# EAGLE schematic Titan_6L_v1p3 (EAGLE 9.6.2)

## Sheet 1 of 5: CPU
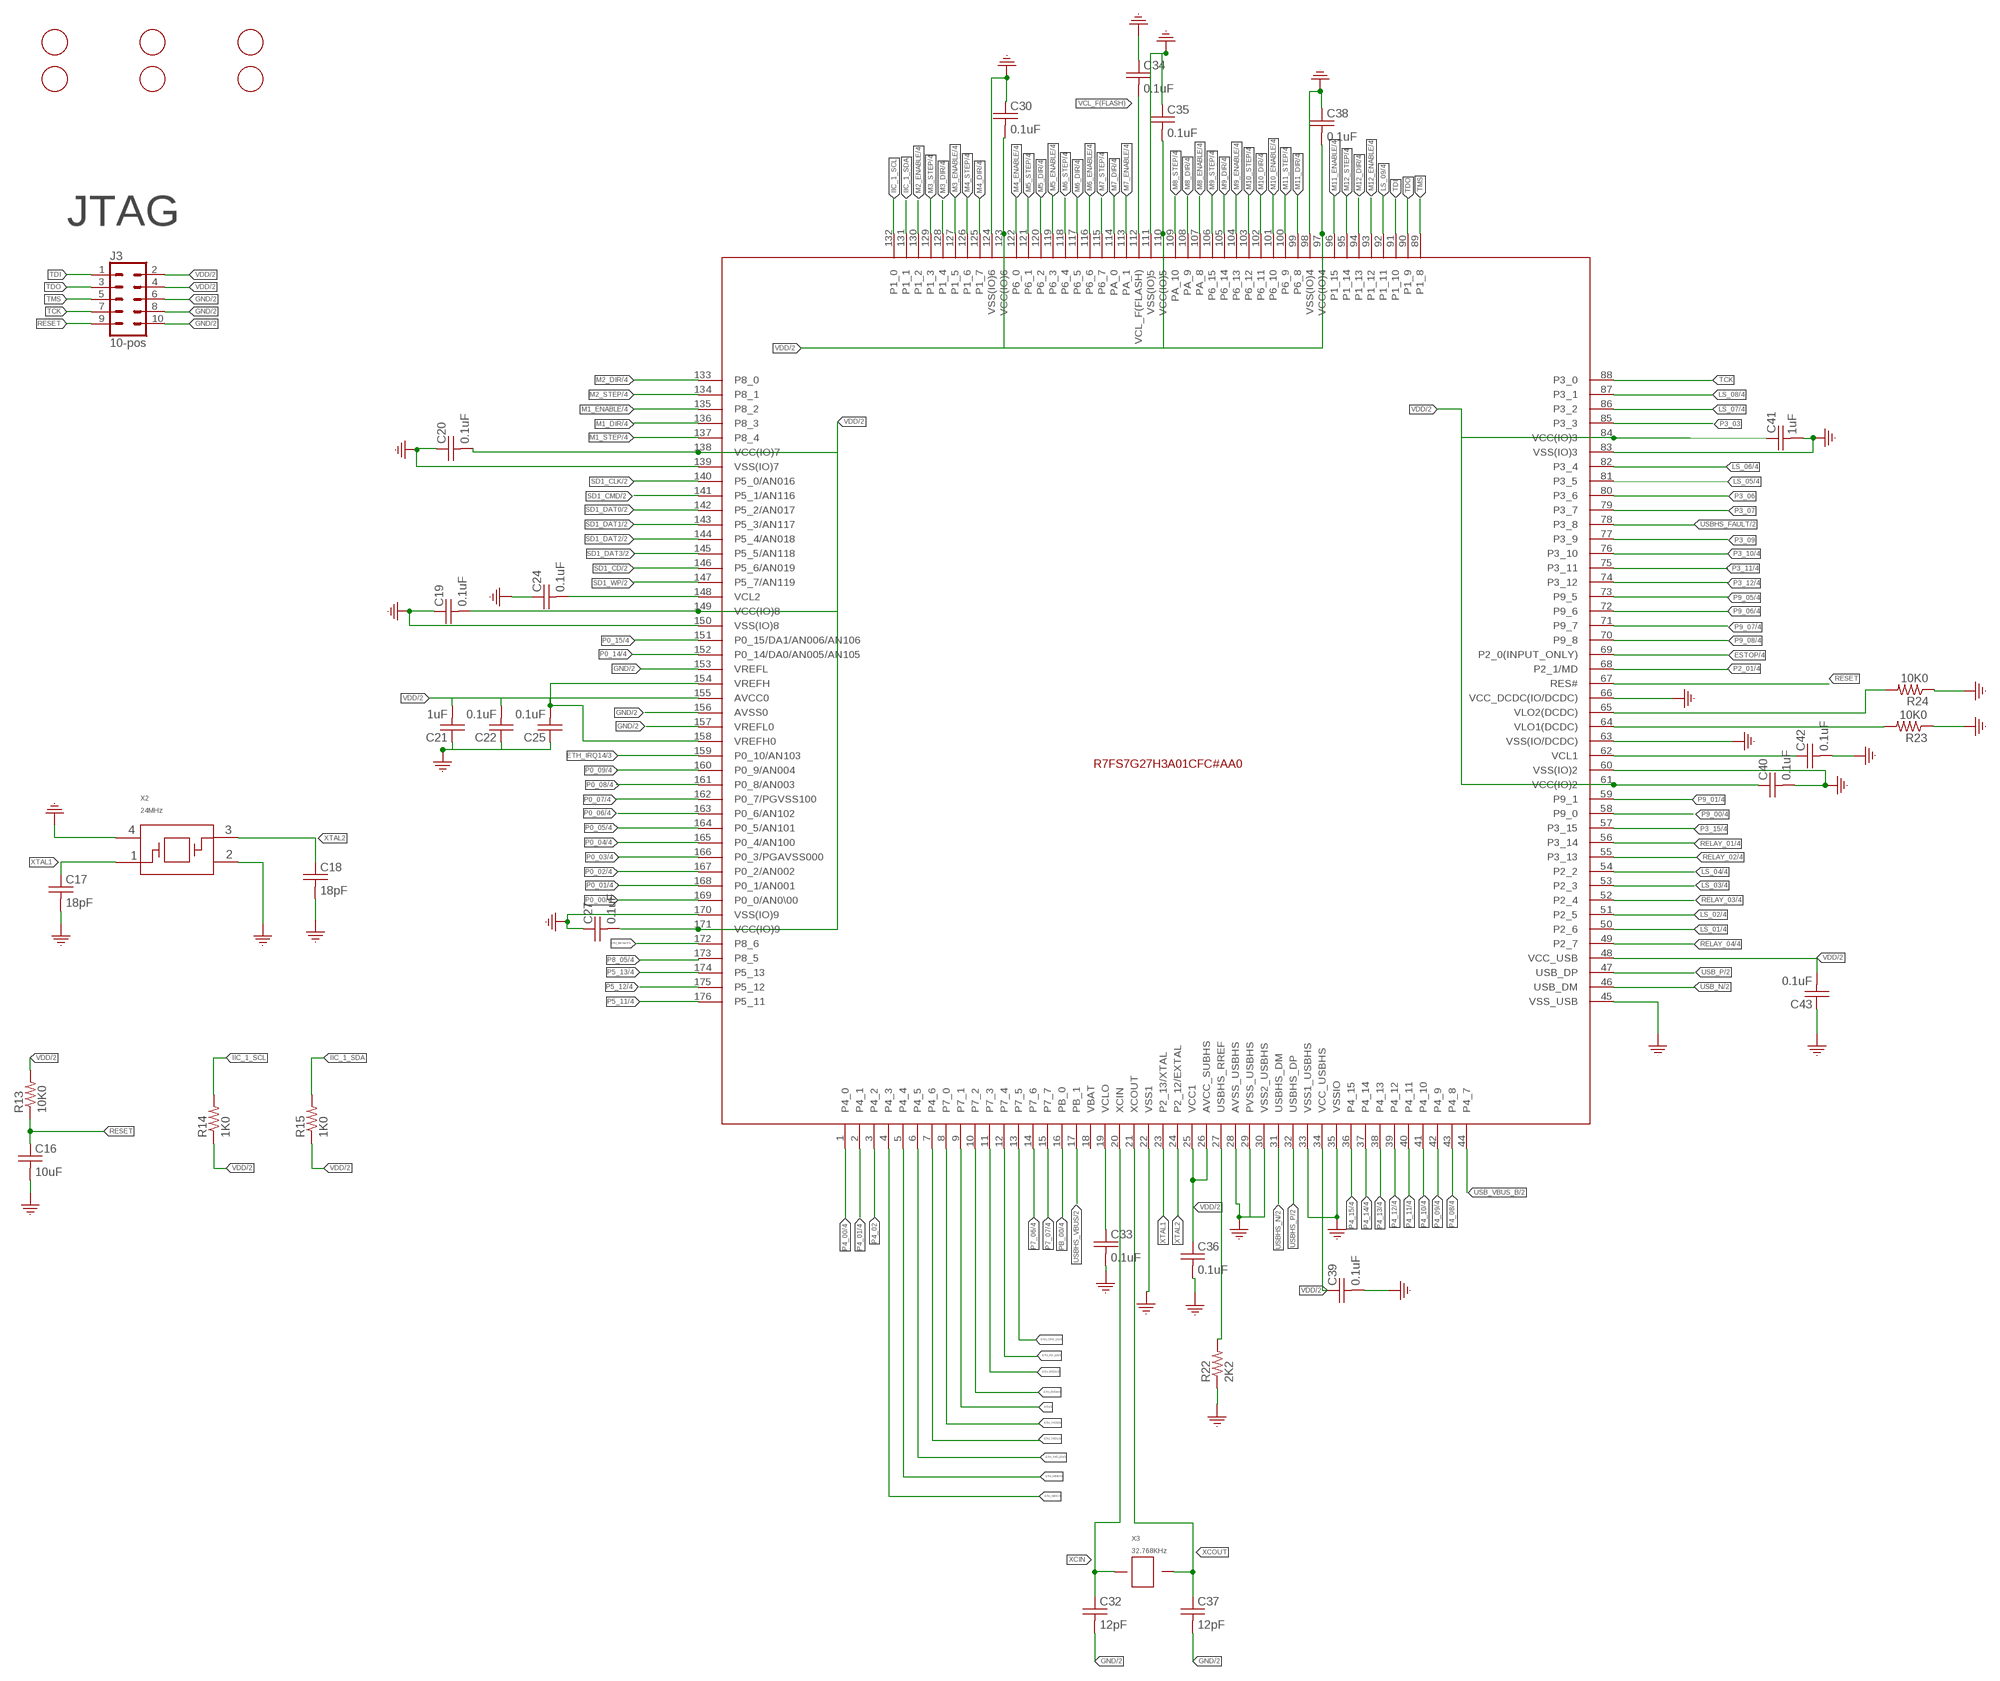
[diagram p0: schematic, sheet 1]

### Parts
AFID1  FIDUCIAL_1MM  [FIDUCIAL_1MM]
AFID2  FIDUCIAL_1MM  [FIDUCIAL_1MM]
AFID3  FIDUCIAL_1MM  [FIDUCIAL_1MM]
AFID4  FIDUCIAL_1MM  [FIDUCIAL_1MM]
AFID5  FIDUCIAL_1MM  [FIDUCIAL_1MM]
AFID6  FIDUCIAL_1MM  [FIDUCIAL_1MM]
C16  10uF  C_0402_10UF  [0402]
C17  18pF  C_0402_18PF  [0402]
C18  18pF  C_0402_18PF  [0402]
C19  0.1uF  C_0402_0.1UF  [0402]
C20  0.1uF  C_0402_0.1UF  [0402]
C21  1uF  C_0402_1UF  [0402]
C22  0.1uF  C_0402_0.1UF  [0402]
C24  0.1uF  C_0402_0.1UF  [0402]
C25  0.1uF  C_0402_0.1UF  [0402]
C27  0.1uF  C_0402_0.1UF  [0402]
C30  0.1uF  C_0402_0.1UF  [0402]
C32  12pF  C_0402_12PF  [0402]
C33  0.1uF  C_0402_0.1UF  [0402]
C34  0.1uF  C_0402_0.1UF  [0402]
C35  0.1uF  C_0402_0.1UF  [0402]
C36  0.1uF  C_0402_0.1UF  [0402]
C37  12pF  C_0402_12PF  [0402]
C38  0.1uF  C_0402_0.1UF  [0402]
C39  0.1uF  C_0402_0.1UF  [0402]
C40  0.1uF  C_0402_0.1UF  [0402]
C41  1uF  C_0402_1UF  [0402]
C42  0.1uF  C_0402_0.1UF  [0402]
C43  0.1uF  C_0402_0.1UF  [0402]
J3  10-pos  CONN_05X2_RAPTH  [2X5]
R13  10K0  R_0402_10K0  [0402]
R14  1K0  R_0402_1K0  [0402]
R15  1K0  R_0402_1K0  [0402]
R22  2K2  R_0402_2K2  [0402]
R23  10K0  R_0402_10K0  [0402]
R24  10K0  R_0402_10K0  [0402]
U3  S7G2LQFP176  RENESAS_S7G2_X_176  [LQFP176_24X24]
X2  24MHz  XTAL_24_MHZ  [SMD_3225]
X3  32.768KHz  XTAL_32.768KHZ  [SMD_X_2_PADS]

### Nets
ESTOP: U3.69(P2_0(INPUT_ONLY)) ; also sheet 4
ETH: U3.9(P7_1) ; also sheet 3
ETH_CRS_DV: U3.13(P7_5) ; also sheet 3
ETH_IRQ14: U3.159(P0_10/AN103) ; also sheet 3
ETH_MDC: U3.4(P4_3) ; also sheet 3
ETH_MDIO: U3.5(P4_4) ; also sheet 3
ETH_RESET: U3.172(P8_6) ; also sheet 3
ETH_RX_ER: U3.12(P7_4) ; also sheet 3
ETH_RXD0: U3.10(P7_2) ; also sheet 3
ETH_RXD1: U3.11(P7_3) ; also sheet 3
ETH_TXD0: U3.8(P7_0) ; also sheet 3
ETH_TXD1: U3.7(P4_6) ; also sheet 3
ETH_TXD_EN: U3.6(P4_5) ; also sheet 3
GND: C16.P$2 C17.P$2 C18.P$2 C19.P$1 C20.P$1 C21.P$1 C22.P$1 C24.P$1 C25.P$1 C27.P$1 C30.P$1 C32.P$2 C33.P$2 C34.P$1 C35.P$1 C36.P$2 C37.P$2 C38.P$1 C39.P$2 C40.P$2 C41.P$2 C42.P$2 C43.P$1 J3.6 J3.8 J3.10 R22.P$1 R23.P$1 R24.P$1 U3.22(VSS1) U3.28(AVSS_USBHS) U3.29(PVSS_USBHS) U3.30(VSS2_USBHS) U3.33(VSS1_USBHS) U3.35(VSSIO) U3.45(VSS_USB) U3.60(VSS(IO)2) U3.63(VSS(IO/DCDC)) U3.66(VCC_DCDC(IO/DCDC)) U3.83(VSS(IO)3) U3.98(VSS(IO)4) U3.111(VSS(IO)5) U3.124(VSS(IO)6) U3.139(VSS(IO)7) U3.150(VSS(IO)8) U3.153(VREFL) U3.156(AVSS0) U3.157(VREFL0) U3.170(VSS(IO)9) X2.2 X2.4 ; also sheet 2,3,4,5
IIC_1_SCL: R14.P$2 U3.132(P1_0)
IIC_1_SDA: R15.P$2 U3.131(P1_1)
LS_01: U3.50(P2_6) ; also sheet 4
LS_02: U3.51(P2_5) ; also sheet 4
LS_03: U3.53(P2_3) ; also sheet 4
LS_04: U3.54(P2_2) ; also sheet 4
LS_05: U3.81(P3_5) ; also sheet 4
LS_06: U3.82(P3_4) ; also sheet 4
LS_07: U3.86(P3_2) ; also sheet 4
LS_08: U3.87(P3_1) ; also sheet 4
LS_09: U3.92(P1_11) ; also sheet 4
M1_DIR: U3.136(P8_3) ; also sheet 4
M1_ENABLE: U3.135(P8_2) ; also sheet 4
M1_STEP: U3.137(P8_4) ; also sheet 4
M2_DIR: U3.133(P8_0) ; also sheet 4
M2_ENABLE: U3.130(P1_2) ; also sheet 4
M2_STEP: U3.134(P8_1) ; also sheet 4
M3_DIR: U3.128(P1_4) ; also sheet 4
M3_ENABLE: U3.127(P1_5) ; also sheet 4
M3_STEP: U3.129(P1_3) ; also sheet 4
M4_DIR: U3.125(P1_7) ; also sheet 4
M4_ENABLE: U3.122(P6_0) ; also sheet 4
M4_STEP: U3.126(P1_6) ; also sheet 4
M5_DIR: U3.120(P6_2) ; also sheet 4
M5_ENABLE: U3.119(P6_3) ; also sheet 4
M5_STEP: U3.121(P6_1) ; also sheet 4
M6_DIR: U3.117(P6_5) ; also sheet 4
M6_ENABLE: U3.116(P6_6) ; also sheet 4
M6_STEP: U3.118(P6_4) ; also sheet 4
M7_DIR: U3.114(PA_0) ; also sheet 4
M7_ENABLE: U3.113(PA_1) ; also sheet 4
M7_STEP: U3.115(P6_7) ; also sheet 4
M8_DIR: U3.108(PA_9) ; also sheet 4
M8_ENABLE: U3.107(PA_8) ; also sheet 4
M8_STEP: U3.109(PA_10) ; also sheet 4
M9_DIR: U3.105(P6_14) ; also sheet 4
M9_ENABLE: U3.104(P6_13) ; also sheet 4
M9_STEP: U3.106(P6_15) ; also sheet 4
M10_DIR: U3.102(P6_11) ; also sheet 4
M10_ENABLE: U3.101(P6_10) ; also sheet 4
M10_STEP: U3.103(P6_12) ; also sheet 4
M11_DIR: U3.99(P6_8) ; also sheet 4
M11_ENABLE: U3.96(P1_15) ; also sheet 4
M11_STEP: U3.100(P6_9) ; also sheet 4
M12_DIR: U3.94(P1_13) ; also sheet 4
M12_ENABLE: U3.93(P1_12) ; also sheet 4
M12_STEP: U3.95(P1_14) ; also sheet 4
N$1: C24.P$2 U3.148(VCL2)
N$4: C33.P$1 U3.19(VCLO)
N$5: C42.P$1 U3.62(VCL1)
N$6: R23.P$2 U3.64(VLO1(DCDC))
N$7: R24.P$2 U3.65(VLO2(DCDC))
N$8: R22.P$2 U3.27(USBHS_RREF)
P0_00: U3.169(P0_0/AN0\00) ; also sheet 4
P0_01: U3.168(P0_1/AN001) ; also sheet 4
P0_02: U3.167(P0_2/AN002) ; also sheet 4
P0_03: U3.166(P0_3/PGAVSS000) ; also sheet 4
P0_04: U3.165(P0_4/AN100) ; also sheet 4
P0_05: U3.164(P0_5/AN101) ; also sheet 4
P0_06: U3.163(P0_6/AN102) ; also sheet 4
P0_07: U3.162(P0_7/PGVSS100) ; also sheet 4
P0_08: U3.161(P0_8/AN003) ; also sheet 4
P0_09: U3.160(P0_9/AN004) ; also sheet 4
P0_14: U3.152(P0_14/DA0/AN005/AN105) ; also sheet 4
P0_15: U3.151(P0_15/DA1/AN006/AN106) ; also sheet 4
P2_01: U3.68(P2_1/MD) ; also sheet 4
P3_03: U3.85(P3_3)
P3_06: U3.80(P3_6)
P3_07: U3.79(P3_7)
P3_09: U3.77(P3_9)
P3_10: U3.76(P3_10) ; also sheet 4
P3_11: U3.75(P3_11) ; also sheet 4
P3_12: U3.74(P3_12) ; also sheet 4
P3_15: U3.57(P3_15) ; also sheet 4
P4_00: U3.1(P4_0) ; also sheet 4
P4_01: U3.2(P4_1) ; also sheet 4
P4_02: U3.3(P4_2)
P4_08: U3.43(P4_8) ; also sheet 4
P4_09: U3.42(P4_9) ; also sheet 4
P4_10: U3.41(P4_10) ; also sheet 4
P4_11: U3.40(P4_11) ; also sheet 4
P4_12: U3.39(P4_12) ; also sheet 4
P4_13: U3.38(P4_13) ; also sheet 4
P4_14: U3.37(P4_14) ; also sheet 4
P4_15: U3.36(P4_15) ; also sheet 4
P5_11: U3.176(P5_11) ; also sheet 4
P5_12: U3.175(P5_12) ; also sheet 4
P5_13: U3.174(P5_13) ; also sheet 4
P7_06: U3.14(P7_6) ; also sheet 4
P7_07: U3.15(P7_7) ; also sheet 4
P8_05: U3.173(P8_5) ; also sheet 4
P9_00: U3.58(P9_0) ; also sheet 4
P9_01: U3.59(P9_1) ; also sheet 4
P9_05: U3.73(P9_5) ; also sheet 4
P9_06: U3.72(P9_6) ; also sheet 4
P9_07: U3.71(P9_7) ; also sheet 4
P9_08: U3.70(P9_8) ; also sheet 4
PB_00: U3.16(PB_0) ; also sheet 4
RELAY_01: U3.56(P3_14) ; also sheet 4
RELAY_02: U3.55(P3_13) ; also sheet 4
RELAY_03: U3.52(P2_4) ; also sheet 4
RELAY_04: U3.49(P2_7) ; also sheet 4
RESET: C16.P$1 J3.9 R13.P$1 U3.67(RES#)
SD1_CD: U3.146(P5_6/AN019) ; also sheet 2
SD1_CLK: U3.140(P5_0/AN016) ; also sheet 2
SD1_CMD: U3.141(P5_1/AN116) ; also sheet 2
SD1_DAT0: U3.142(P5_2/AN017) ; also sheet 2
SD1_DAT1: U3.143(P5_3/AN117) ; also sheet 2
SD1_DAT2: U3.144(P5_4/AN018) ; also sheet 2
SD1_DAT3: U3.145(P5_5/AN118) ; also sheet 2
SD1_WP: U3.147(P5_7/AN119) ; also sheet 2
TCK: J3.7 U3.88(P3_0)
TDI: J3.1 U3.91(P1_10)
TDO: J3.3 U3.90(P1_9)
TMS: J3.5 U3.89(P1_8)
USB_N: U3.46(USB_DM) ; also sheet 2
USB_P: U3.47(USB_DP) ; also sheet 2
USB_VBUS_B: U3.44(P4_7) ; also sheet 2
USBHS_FAULT: U3.78(P3_8) ; also sheet 2
USBHS_N: U3.31(USBHS_DM) ; also sheet 2
USBHS_P: U3.32(USBHS_DP) ; also sheet 2
USBHS_VBUS: U3.17(PB_1) ; also sheet 2
VCL_F(FLASH): C34.P$2 U3.112(VCL_F(FLASH))
VDD: C19.P$2 C20.P$2 C21.P$2 C22.P$2 C25.P$2 C27.P$2 C30.P$2 C35.P$2 C36.P$1 C38.P$2 C39.P$1 C40.P$1 C41.P$1 C43.P$2 J3.2 J3.4 R13.P$2 R14.P$1 R15.P$1 U3.25(VCC1) U3.26(AVCC_SUBHS) U3.34(VCC_USBHS) U3.48(VCC_USB) U3.61(VCC(IO)2) U3.84(VCC(IO)3) U3.97(VCC(IO)4) U3.110(VCC(IO)5) U3.123(VCC(IO)6) U3.138(VCC(IO)7) U3.149(VCC(IO)8) U3.154(VREFH) U3.155(AVCC0) U3.158(VREFH0) U3.171(VCC(IO)9) ; also sheet 2,3,4,5
XCIN: C32.P$1 U3.20(XCIN) X3.P$1
XCOUT: C37.P$1 U3.21(XCOUT) X3.P$2
XTAL1: C17.P$1 U3.23(P2_13/XTAL) X2.1
XTAL2: C18.P$1 U3.24(P2_12/EXTAL) X2.3
Unconnected: U3.18(VBAT)

### Notes on the sheet
- JTAG

## Sheet 2 of 5: USB and SD Card
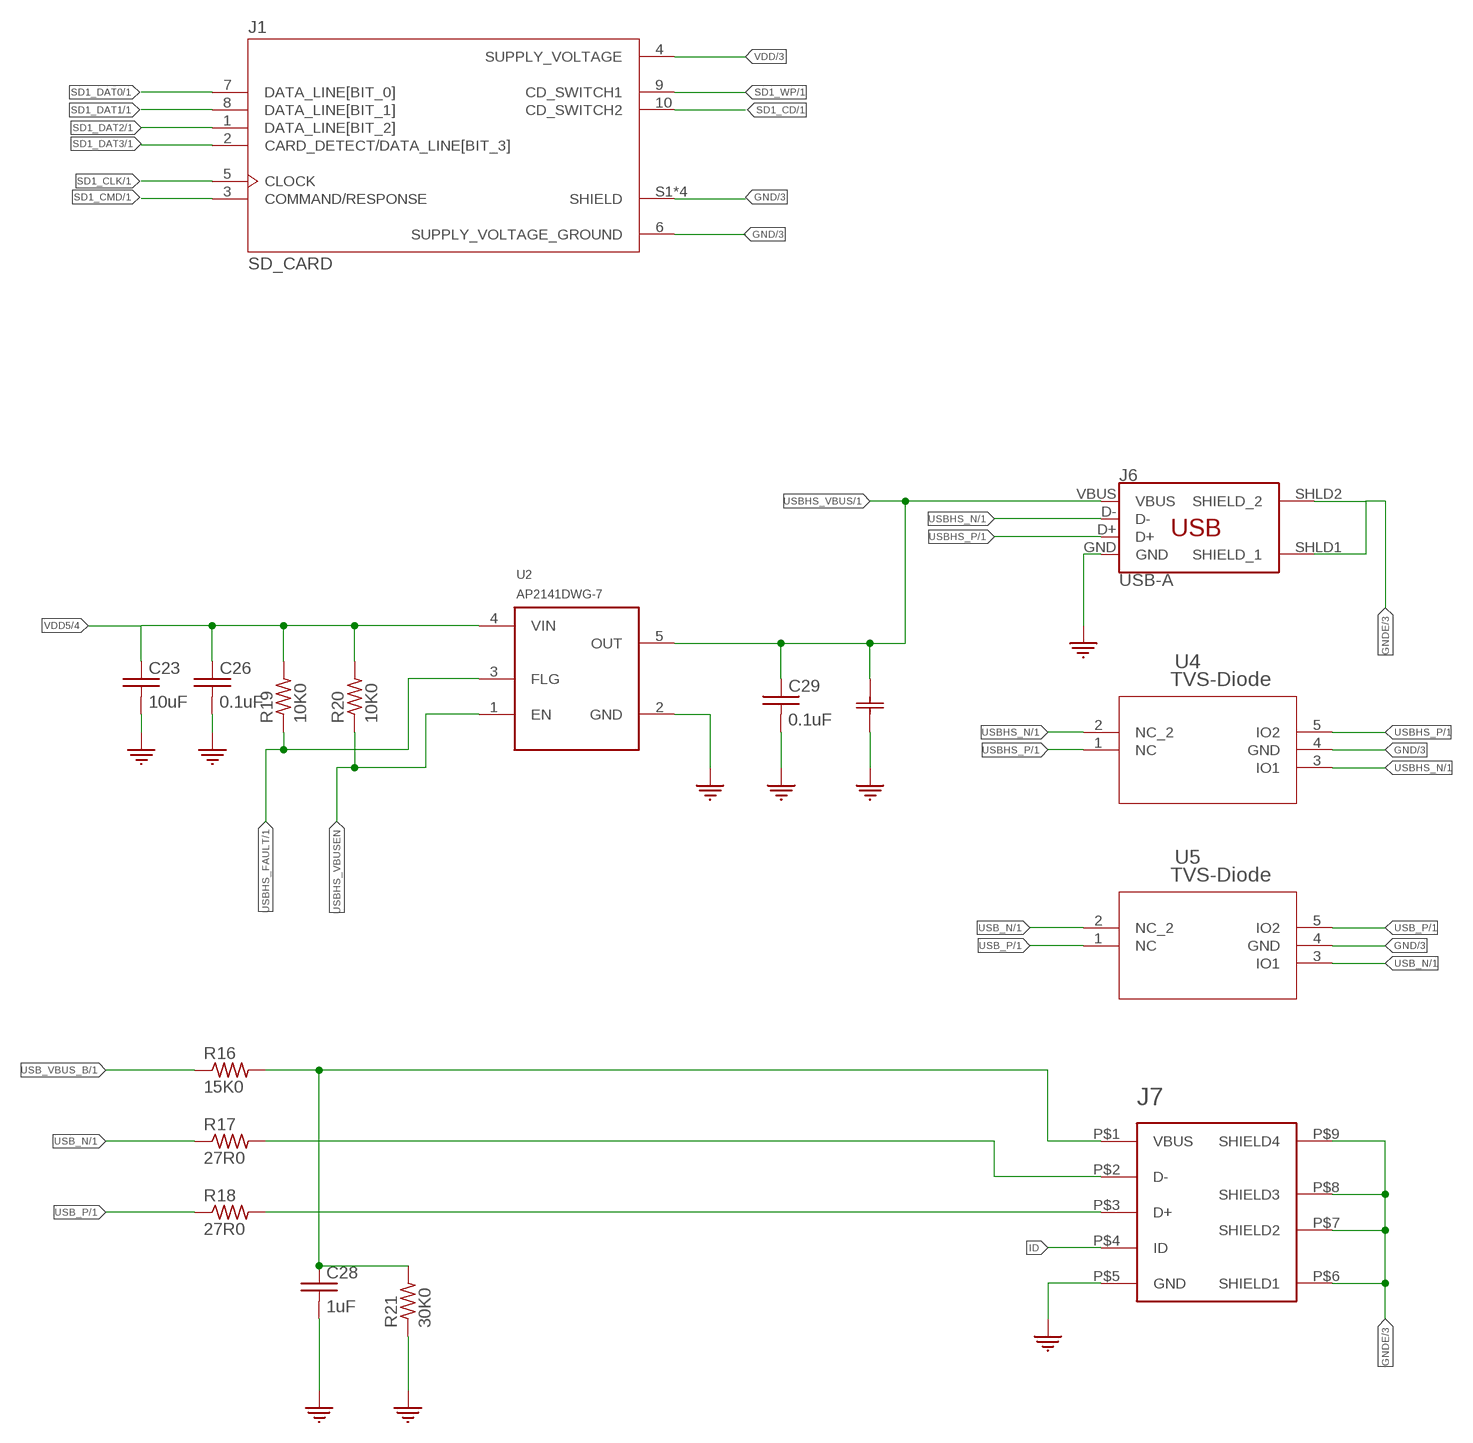
[diagram p1: schematic, sheet 2]

### Parts
C1  TLJT107M010R0900CAP_1210TJLJ_3P5X2P8_DIO-M  [CAP_1210TJLJ_3P5X2P8_DIO-M]
C23  10uF  C_0402_10UF  [0402]
C26  0.1uF  C_0402_0.1UF  [0402]
C28  1uF  C_0402_1UF  [0402]
C29  0.1uF  C_0402_0.1UF  [0402]
J1  SD_CARD  SD_CARD_1140084168  [SD_CARD]
J6  USB-A  USB_A  [USB_A_SMT]
J7  USB-B-Micro  USB_MICRO-B  [USB_MICRO-B]
R16  15K0  R_0402_15K0  [0402]
R17  27R0  R_0402_27R0  [0402]
R18  27R0  R_0402_27R0  [0402]
R19  10K0  R_0402_10K0  [0402]
R20  10K0  R_0402_10K0  [0402]
R21  30K0  R_0402_30K0  [0402]
U2  AP2151DWG-7  [SOT-23-5]
U4  TVS-Diode  TPD2E2U06DRLR  [DRL5]
U5  TVS-Diode  TPD2E2U06DRLR  [DRL5]

### Nets
D+: J7.P$3(D+) R18.P$2
D-: J7.P$2(D-) R17.P$2
GND: C1.2 C23.P$2 C26.P$2 C28.P$2 C29.P$2 J1.6(SUPPLY_VOLTAGE_GROUND) J1.S1(SHIELD) J1.S2(SHIELD) J1.S3(SHIELD) J1.S4(SHIELD) J6.GND J7.P$5(GND) R21.P$1 U2.2(GND) U4.4(GND) U5.4(GND) ; also sheet 1,3,4,5
GNDE: J6.SHLD1(SHIELD_1) J6.SHLD2(SHIELD_2) J7.P$6(SHIELD1) J7.P$7(SHIELD2) J7.P$8(SHIELD3) J7.P$9(SHIELD4) ; also sheet 3,5
ID: J7.P$4(ID)
SD1_CD: J1.10(CD_SWITCH2) ; also sheet 1
SD1_CLK: J1.5(CLOCK) ; also sheet 1
SD1_CMD: J1.3(COMMAND/RESPONSE) ; also sheet 1
SD1_DAT0: J1.7(DATA_LINE[BIT_0]) ; also sheet 1
SD1_DAT1: J1.8(DATA_LINE[BIT_1]) ; also sheet 1
SD1_DAT2: J1.1(DATA_LINE[BIT_2]) ; also sheet 1
SD1_DAT3: J1.2(CARD_DETECT/DATA_LINE[BIT_3]) ; also sheet 1
SD1_WP: J1.9(CD_SWITCH1) ; also sheet 1
USB_N: R17.P$1 U5.2(NC_2) U5.3(IO1) ; also sheet 1
USB_P: R18.P$1 U5.1(NC) U5.5(IO2) ; also sheet 1
USB_VBUS_B: R16.P$1 ; also sheet 1
USBHS_FAULT: R19.P$1 U2.3(FLG) ; also sheet 1
USBHS_N: J6.D- U4.2(NC_2) U4.3(IO1) ; also sheet 1
USBHS_P: J6.D+ U4.1(NC) U4.5(IO2) ; also sheet 1
USBHS_VBUS: C1.1 C29.P$1 J6.VBUS U2.5(OUT) ; also sheet 1
USBHS_VBUSEN: R20.P$1 U2.1(EN)
VBUS: C28.P$1 J7.P$1(VBUS) R16.P$2 R21.P$2
VDD: J1.4(SUPPLY_VOLTAGE) ; also sheet 1,3,4,5
VDD5: C23.P$1 C26.P$1 R19.P$2 R20.P$2 U2.4(VIN) ; also sheet 4,5

## Sheet 3 of 5: Ethernet
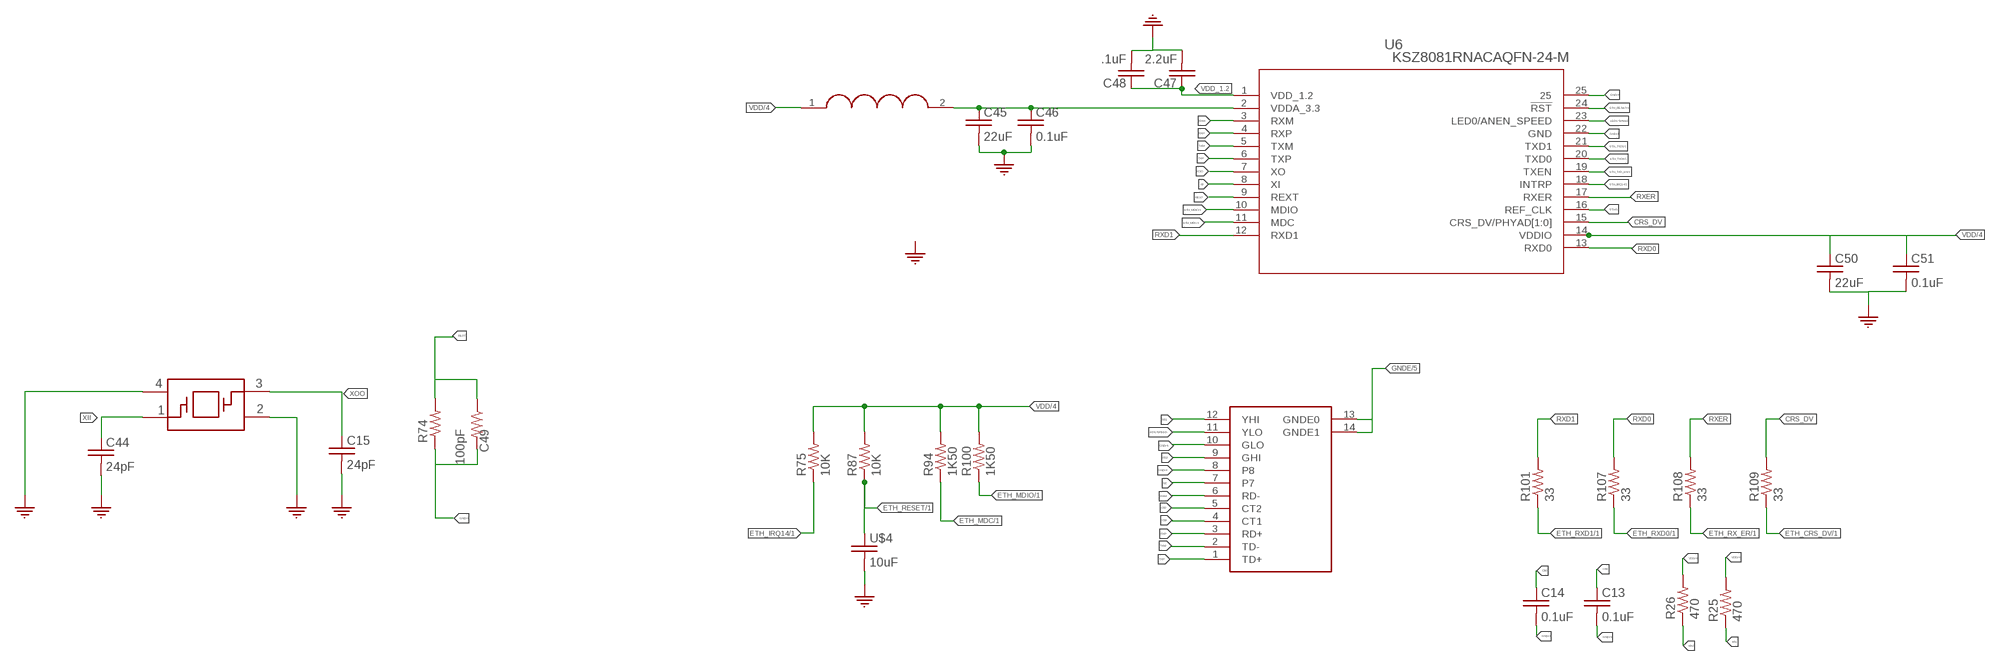
[diagram p2: schematic, sheet 3]

### Parts
C13  0.1uF  C_0402  [0402]
C14  0.1uF  C_0402  [0402]
C15  24pF  C_0402  [0402]
C44  24pF  C_0402  [0402]
C45  22uF  C_0603  [0603]
C46  0.1uF  C_0402  [0402]
C47  2.2uF  C_0402  [0402]
C48  .1uF  C_0402  [0402]
C49  100pF  R_0402  [0402]
C50  22uF  C_0603  [0603]
C51  0.1uF  C_0402  [0402]
FB2/2  FB_0805_120_OHM  [0805]
R25  470  R_0402  [0402]
R26  470  R_0402  [0402]
R74  6k49  R_0402  [0402]
R75  10K  R_0402  [0402]
R87  10K  R_0402  [0402]
R94  1K50  R_0402  [0402]
R100  1K50  R_0402  [0402]
R101  33  R_0402  [0402]
R107  33  R_0402  [0402]
R108  33  R_0402  [0402]
R109  33  R_0402  [0402]
U6  KSZ8081RNACAQFN-24-M  [QFN-24-M]
U$2  RJ45_WITH_ELEC  [RJ45_TH_ELEC]
U$3  XTAL_25_MHZ  [SMD_3225]
U$4  10uF  C_0402  [0402]

### Nets
C58: C13.P$1 U$2.4(CT1)
C60: C14.P$1 U$2.5(CT2)
CRS_DV: R109.P$2 U6.15(CRS_DV/PHYAD[1:0])
ETH: U6.16(REF_CLK) ; also sheet 1
ETH_CRS_DV: R109.P$1 ; also sheet 1
ETH_IRQ14: R75.P$1 U6.18(INTRP) ; also sheet 1
ETH_MDC: R94.P$1 U6.11(MDC) ; also sheet 1
ETH_MDIO: R100.P$1 U6.10(MDIO) ; also sheet 1
ETH_RESET: R87.P$1 U6.24(!RST) U$4.P$1 ; also sheet 1
ETH_RX_ER: R108.P$1 ; also sheet 1
ETH_RXD0: R107.P$1 ; also sheet 1
ETH_RXD1: R101.P$1 ; also sheet 1
ETH_TXD0: U6.20(TXD0) ; also sheet 1
ETH_TXD1: U6.21(TXD1) ; also sheet 1
ETH_TXD_EN: U6.19(TXEN) ; also sheet 1
GND: C13.P$2 C14.P$2 C15.P$2 C44.P$2 C45.2 C46.P$2 C47.P$2 C48.P$2 C49.P$2 C50.2 C51.P$2 R74.P$1 U6.22(GND) U6.25 U$2.8 U$2.10(GLO) U$3.2 U$3.4 U$4.P$2 ; also sheet 1,2,4,5
GNDE: U$2.13(GNDE0) U$2.14(GNDE1) ; also sheet 2,5
LED1/SPEED: U6.23(LED0/ANEN_SPEED) U$2.11(YLO)
NC: U$2.7
R51: R25.P$1 U$2.12(YHI)
R52: R26.P$1 U$2.9(GHI)
REXT: C49.P$1 R74.P$2 U6.9(REXT)
RXD0: R107.P$2 U6.13(RXD0)
RXD1: R101.P$2 U6.12(RXD1)
RXER: R108.P$2 U6.17(RXER)
RXM: U6.3(RXM) U$2.6(RD-)
RXP: U6.4(RXP) U$2.3(RD+)
TXM: U6.5(TXM) U$2.2(TD-)
TXP: U6.6(TXP) U$2.1(TD+)
VDD: C50.1 C51.P$1 FB2/2.1 R25.P$2 R26.P$2 R75.P$2 R87.P$2 R94.P$2 R100.P$2 U6.14(VDDIO) ; also sheet 1,2,4,5
VDD_1.2: C47.P$1 C48.P$1 U6.1(VDD_1.2)
VDD_ENET1: C45.1 C46.P$1 FB2/2.2 U6.2(VDDA_3.3)
XII: C44.P$1 U6.8(XI) U$3.1
XOO: C15.P$1 U6.7(XO) U$3.3

## Sheet 4 of 5: IO
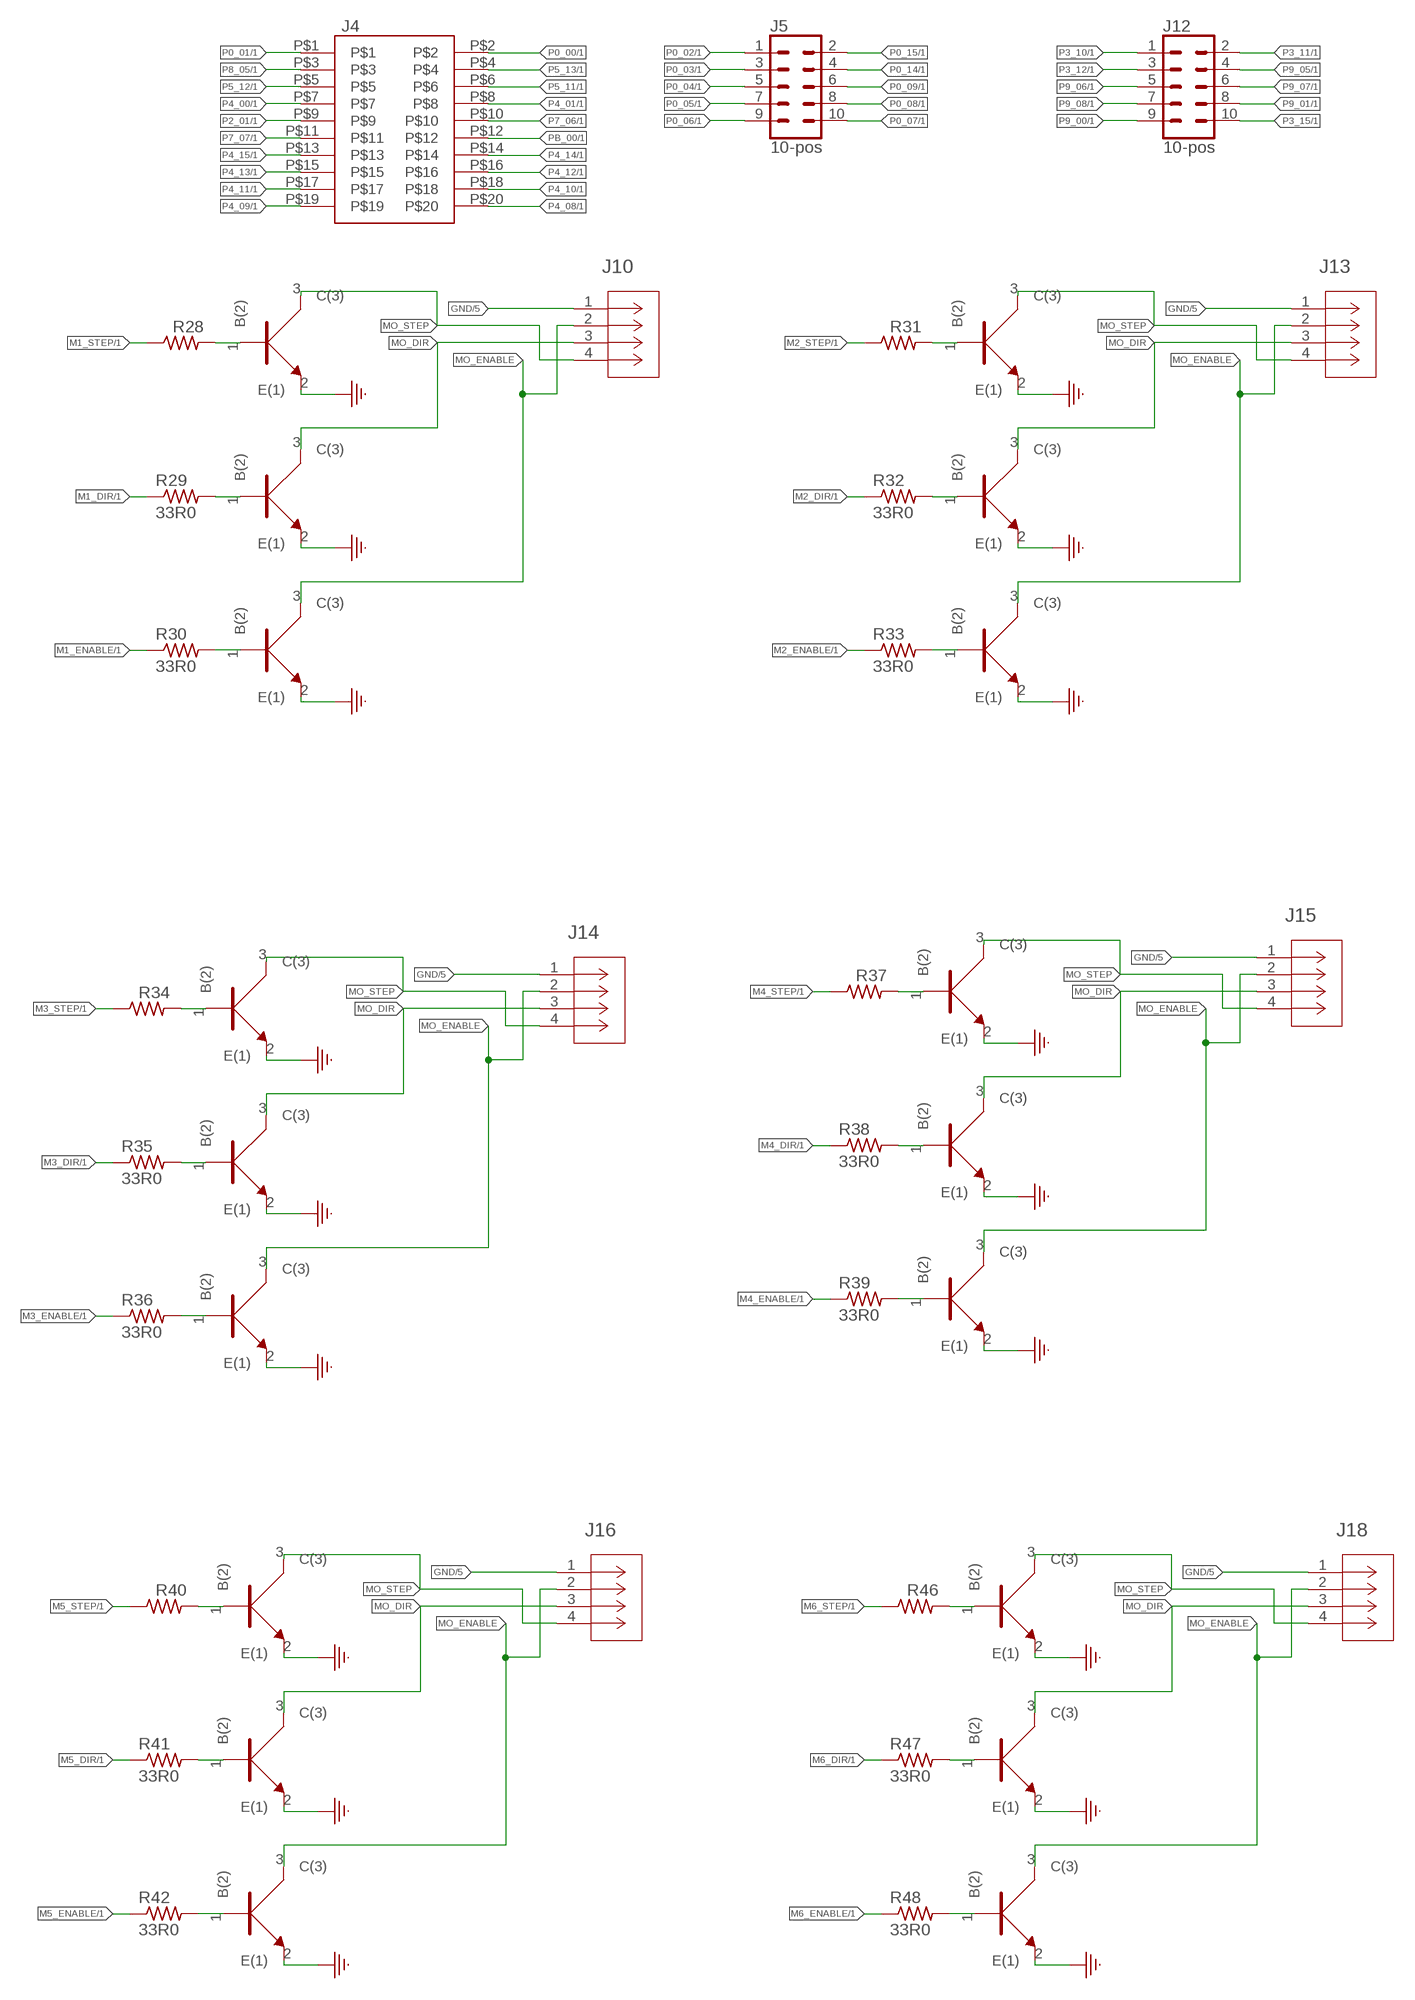
[diagram p3: schematic, sheet 4, part 1 of 3]
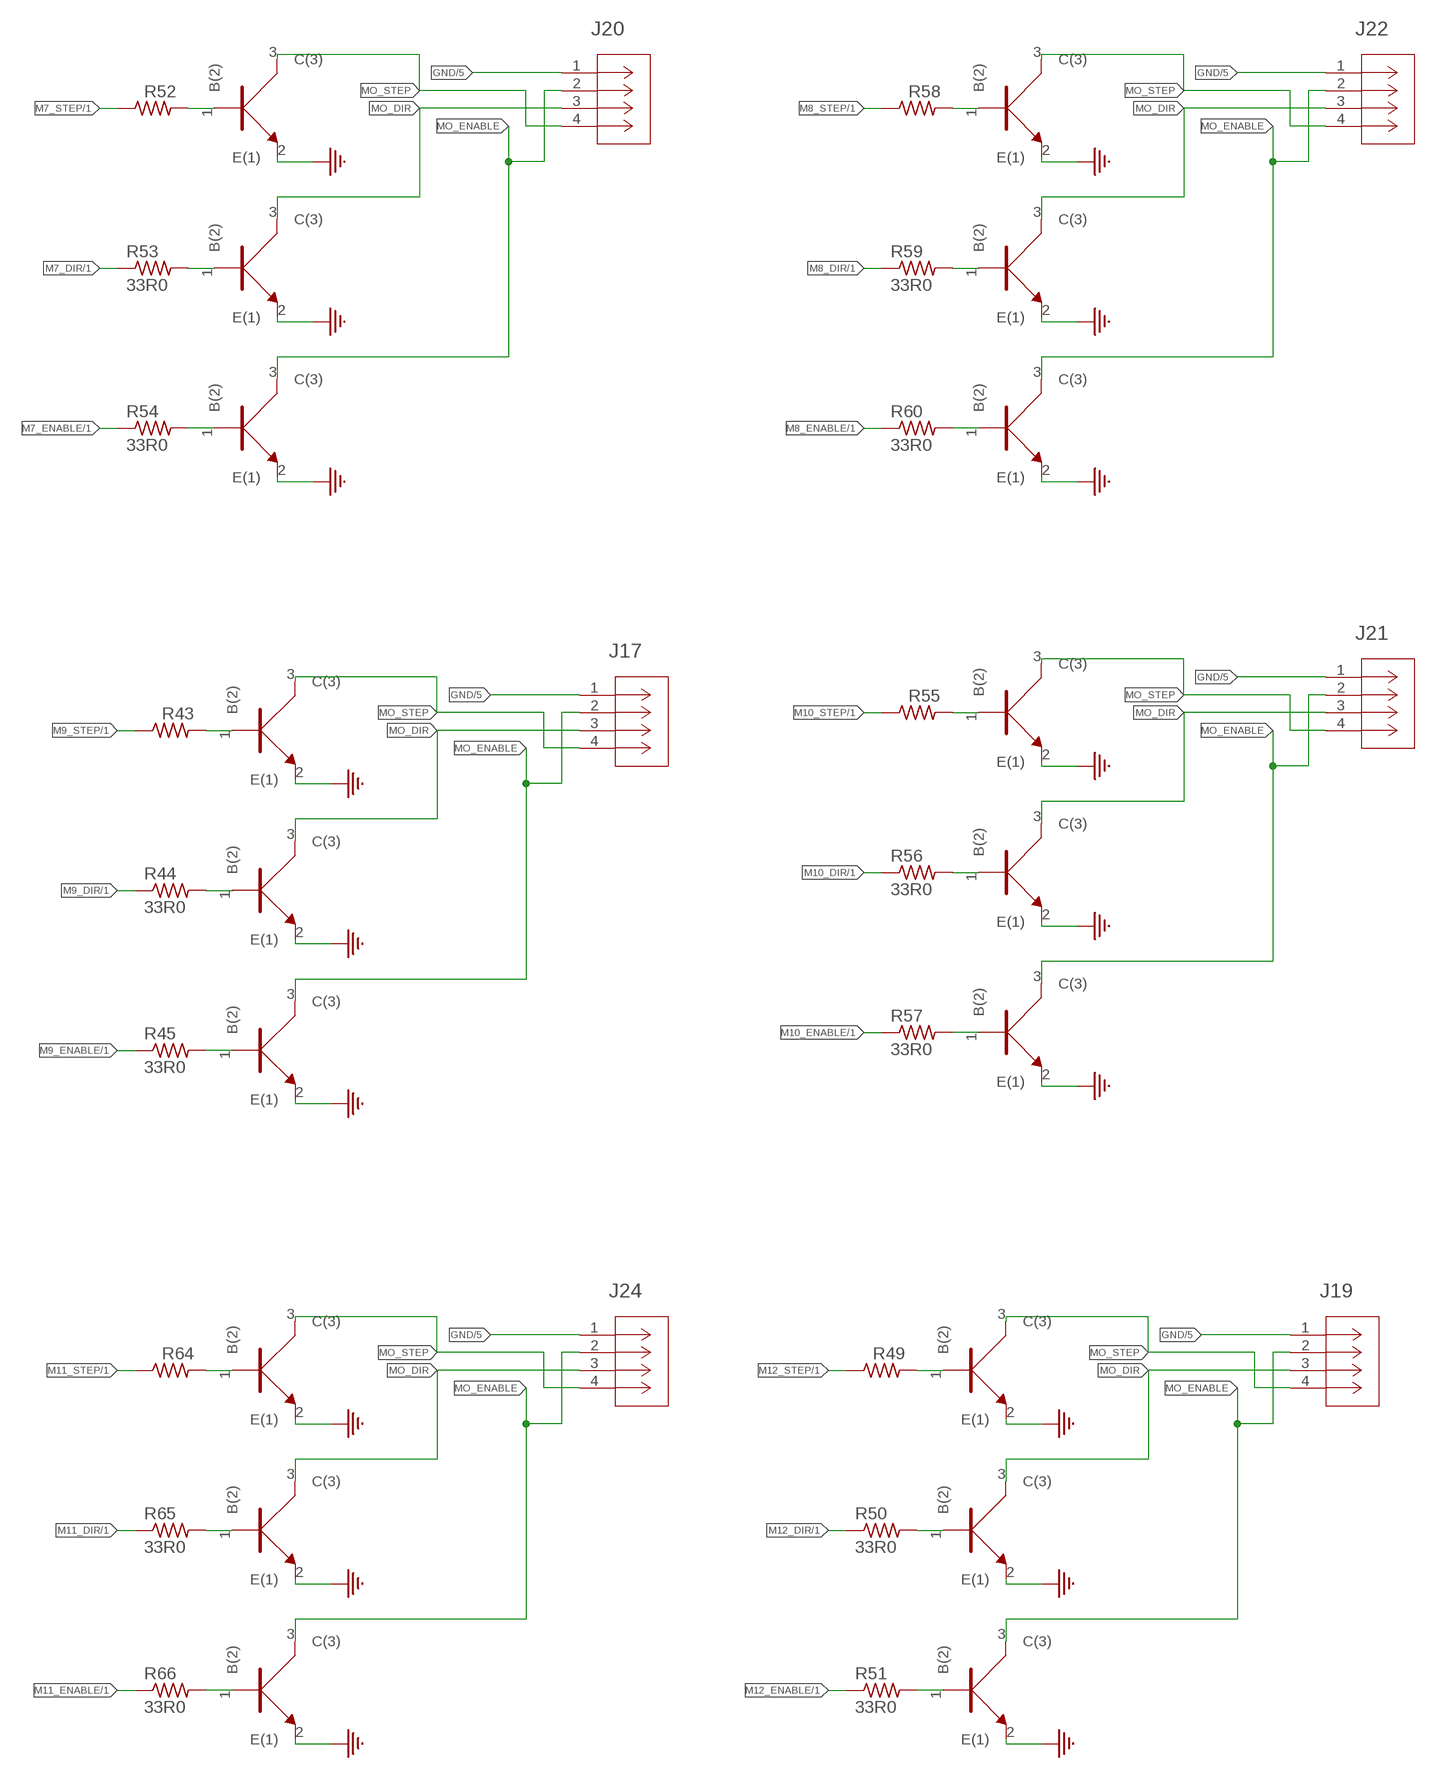
[diagram p4: schematic, sheet 4, part 2 of 3]
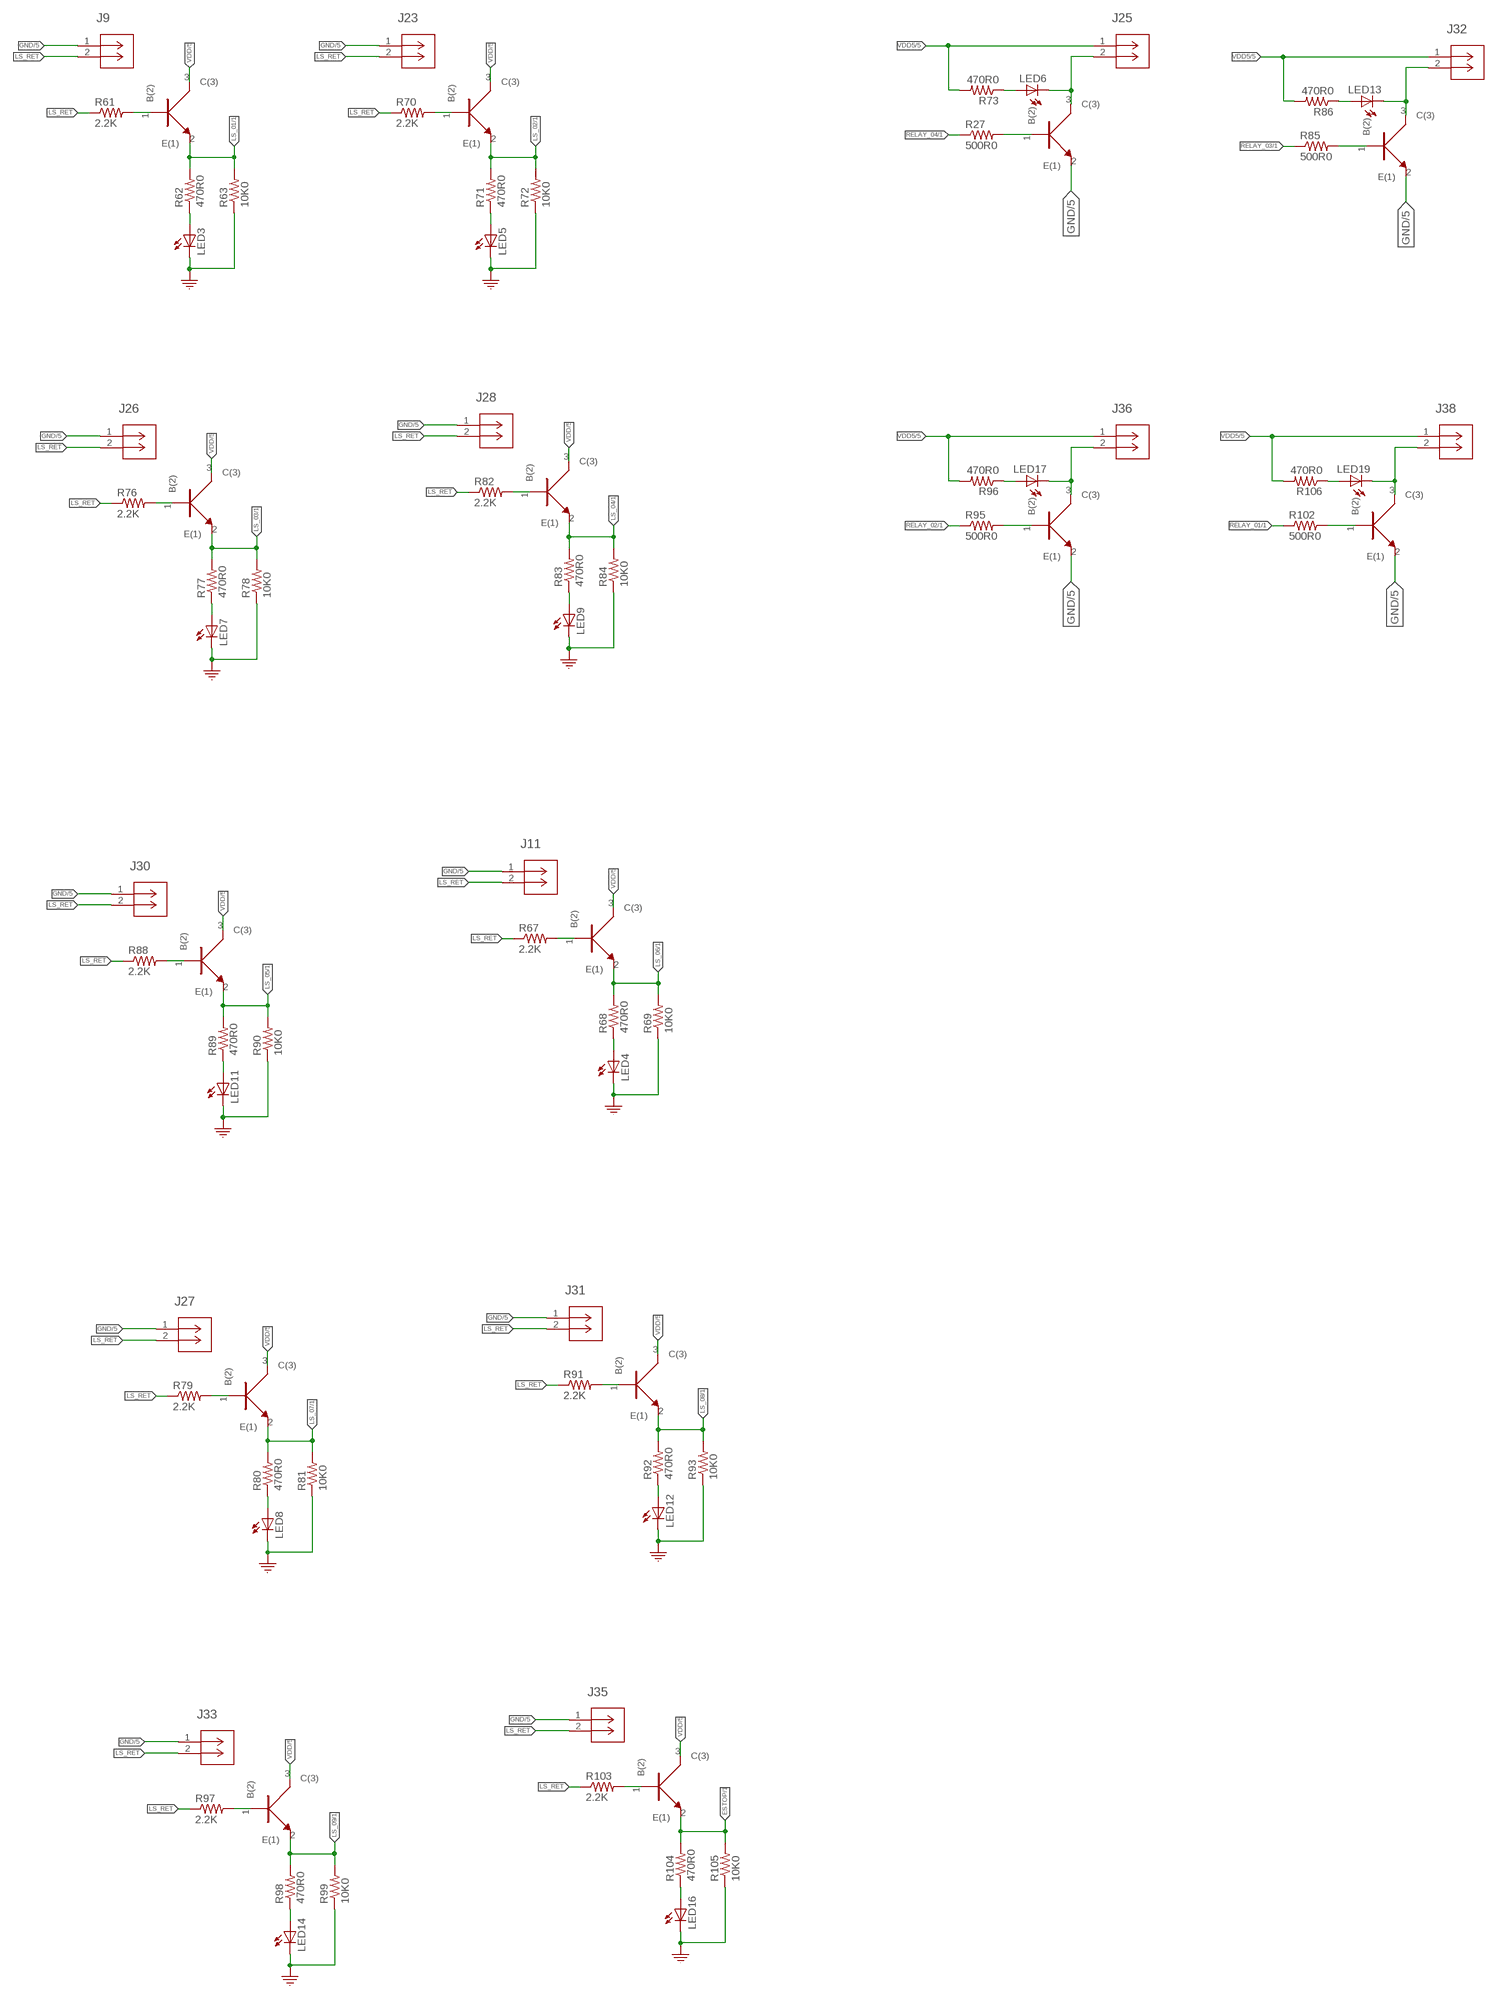
[diagram p5: schematic, sheet 4, part 3 of 3]

### Parts
J4  20-pos  2_X_10_HEADER_GENERIC  [2_X_10_.1_INCH]
J5  10-pos  CONN_05X2_RAPTH  [2X5]
J9  CONN_530470210_PICOBLADE_X_2  [CON_530470210_MOL]
J10  CONN_530470410_PICOBLADE_X_4  [CON_530470410_MOL]
J11  CONN_530470210_PICOBLADE_X_2  [CON_530470210_MOL]
J12  10-pos  CONN_05X2_RAPTH  [2X5]
J13  CONN_530470410_PICOBLADE_X_4  [CON_530470410_MOL]
J14  CONN_530470410_PICOBLADE_X_4  [CON_530470410_MOL]
J15  CONN_530470410_PICOBLADE_X_4  [CON_530470410_MOL]
J16  CONN_530470410_PICOBLADE_X_4  [CON_530470410_MOL]
J17  CONN_530470410_PICOBLADE_X_4  [CON_530470410_MOL]
J18  CONN_530470410_PICOBLADE_X_4  [CON_530470410_MOL]
J19  CONN_530470410_PICOBLADE_X_4  [CON_530470410_MOL]
J20  CONN_530470410_PICOBLADE_X_4  [CON_530470410_MOL]
J21  CONN_530470410_PICOBLADE_X_4  [CON_530470410_MOL]
J22  CONN_530470410_PICOBLADE_X_4  [CON_530470410_MOL]
J23  CONN_530470210_PICOBLADE_X_2  [CON_530470210_MOL]
J24  CONN_530470410_PICOBLADE_X_4  [CON_530470410_MOL]
J25  CONN_530470210_PICOBLADE_X_2  [CON_530470210_MOL]
J26  CONN_530470210_PICOBLADE_X_2  [CON_530470210_MOL]
J27  CONN_530470210_PICOBLADE_X_2  [CON_530470210_MOL]
J28  CONN_530470210_PICOBLADE_X_2  [CON_530470210_MOL]
J30  CONN_530470210_PICOBLADE_X_2  [CON_530470210_MOL]
J31  CONN_530470210_PICOBLADE_X_2  [CON_530470210_MOL]
J32  CONN_530470210_PICOBLADE_X_2  [CON_530470210_MOL]
J33  CONN_530470210_PICOBLADE_X_2  [CON_530470210_MOL]
J35  CONN_530470210_PICOBLADE_X_2  [CON_530470210_MOL]
J36  CONN_530470210_PICOBLADE_X_2  [CON_530470210_MOL]
J38  CONN_530470210_PICOBLADE_X_2  [CON_530470210_MOL]
LED3  Green  LED_0805_GREEN  [0805]
LED4  Green  LED_0805_GREEN  [0805]
LED5  Green  LED_0805_GREEN  [0805]
LED6  Green  LED_0805_GREEN  [0805]
LED7  Green  LED_0805_GREEN  [0805]
LED8  Green  LED_0805_GREEN  [0805]
LED9  Green  LED_0805_GREEN  [0805]
LED11  Green  LED_0805_GREEN  [0805]
LED12  Green  LED_0805_GREEN  [0805]
LED13  Green  LED_0805_GREEN  [0805]
LED14  Green  LED_0805_GREEN  [0805]
LED16  Green  LED_0805_GREEN  [0805]
LED17  Green  LED_0805_GREEN  [0805]
LED19  Green  LED_0805_GREEN  [0805]
R27  500R0  R_0402  [0402]
R28  33R0  R_0402_33R0  [0402]
R29  33R0  R_0402_33R0  [0402]
R30  33R0  R_0402_33R0  [0402]
R31  33R0  R_0402_33R0  [0402]
R32  33R0  R_0402_33R0  [0402]
R33  33R0  R_0402_33R0  [0402]
R34  33R0  R_0402_33R0  [0402]
R35  33R0  R_0402_33R0  [0402]
R36  33R0  R_0402_33R0  [0402]
R37  33R0  R_0402_33R0  [0402]
R38  33R0  R_0402_33R0  [0402]
R39  33R0  R_0402_33R0  [0402]
R40  33R0  R_0402_33R0  [0402]
R41  33R0  R_0402_33R0  [0402]
R42  33R0  R_0402_33R0  [0402]
R43  33R0  R_0402_33R0  [0402]
R44  33R0  R_0402_33R0  [0402]
R45  33R0  R_0402_33R0  [0402]
R46  33R0  R_0402_33R0  [0402]
R47  33R0  R_0402_33R0  [0402]
R48  33R0  R_0402_33R0  [0402]
R49  33R0  R_0402_33R0  [0402]
R50  33R0  R_0402_33R0  [0402]
R51  33R0  R_0402_33R0  [0402]
R52  33R0  R_0402_33R0  [0402]
R53  33R0  R_0402_33R0  [0402]
R54  33R0  R_0402_33R0  [0402]
R55  33R0  R_0402_33R0  [0402]
R56  33R0  R_0402_33R0  [0402]
R57  33R0  R_0402_33R0  [0402]
R58  33R0  R_0402_33R0  [0402]
R59  33R0  R_0402_33R0  [0402]
R60  33R0  R_0402_33R0  [0402]
R61  2.2K  R_0402  [0402]
R62  470R0  R_0402_470R0  [0402]
R63  10K0  R_0402_10K0  [0402]
R64  33R0  R_0402_33R0  [0402]
R65  33R0  R_0402_33R0  [0402]
R66  33R0  R_0402_33R0  [0402]
R67  2.2K  R_0402  [0402]
R68  470R0  R_0402_470R0  [0402]
R69  10K0  R_0402_10K0  [0402]
R70  2.2K  R_0402  [0402]
R71  470R0  R_0402_470R0  [0402]
R72  10K0  R_0402_10K0  [0402]
R73  470R0  R_0402_470R0  [0402]
R76  2.2K  R_0402  [0402]
R77  470R0  R_0402_470R0  [0402]
R78  10K0  R_0402_10K0  [0402]
R79  2.2K  R_0402  [0402]
R80  470R0  R_0402_470R0  [0402]
R81  10K0  R_0402_10K0  [0402]
R82  2.2K  R_0402  [0402]
R83  470R0  R_0402_470R0  [0402]
R84  10K0  R_0402_10K0  [0402]
R85  500R0  R_0402  [0402]
R86  470R0  R_0402_470R0  [0402]
R88  2.2K  R_0402  [0402]
R89  470R0  R_0402_470R0  [0402]
R90  10K0  R_0402_10K0  [0402]
R91  2.2K  R_0402  [0402]
R92  470R0  R_0402_470R0  [0402]
R93  10K0  R_0402_10K0  [0402]
R95  500R0  R_0402  [0402]
R96  470R0  R_0402_470R0  [0402]
R97  2.2K  R_0402  [0402]
R98  470R0  R_0402_470R0  [0402]
R99  10K0  R_0402_10K0  [0402]
R102  500R0  R_0402  [0402]
R103  2.2K  R_0402  [0402]
R104  470R0  R_0402_470R0  [0402]
R105  10K0  R_0402_10K0  [0402]
R106  470R0  R_0402_470R0  [0402]
U7  NPN  BC846BW  [SOT323]
U8  NPN  BC846BW  [SOT323]
U9  NPN  BC846BW  [SOT323]
U10  NPN  BC846BW  [SOT323]
U11  NPN  BC846BW  [SOT323]
U12  NPN  BC846BW  [SOT323]
U13  NPN  BC846BW  [SOT323]
U14  NPN  BC846BW  [SOT323]
U15  NPN  BC846BW  [SOT323]
U16  NPN  BC846BW  [SOT323]
U17  NPN  BC846BW  [SOT323]
U18  NPN  BC846BW  [SOT323]
U19  NPN  BC846BW  [SOT323]
U20  NPN  BC846BW  [SOT323]
U21  NPN  BC846BW  [SOT323]
U22  NPN  BC846BW  [SOT323]
U23  NPN  BC846BW  [SOT323]
U24  NPN  BC846BW  [SOT323]
U25  NPN  BC846BW  [SOT323]
U26  NPN  BC846BW  [SOT323]
U27  NPN  BC846BW  [SOT323]
U28  NPN  BC846BW  [SOT323]
U29  NPN  BC846BW  [SOT323]
U30  NPN  BC846BW  [SOT323]
U31  NPN  BC846BW  [SOT323]
U32  NPN  BC846BW  [SOT323]
U33  NPN  BC846BW  [SOT323]
U34  NPN  BC846BW  [SOT323]
U35  NPN  BC846BW  [SOT323]
U36  NPN  BC846BW  [SOT323]
U37  NPN  BC846BW  [SOT323]
U38  NPN  BC846BW  [SOT323]
U39  NPN  BC846BW  [SOT323]
U40  NPN  BC846BW  [SOT323]
U41  NPN  BC846BW  [SOT323]
U42  NPN  BC846BW  [SOT323]
U43  NPN  BC846BW  [SOT323]
U44  NPN  BC846BW  [SOT323]
U45  NPN  BC846BW  [SOT323]
U46  NPN  BC846BW  [SOT323]
U47  NPN  BC846BW  [SOT323]
U48  NPN  BC846BW  [SOT323]
U49  NPN  BC846BW  [SOT323]
U51  NPN  BC846BW  [SOT323]
U52  NPN  BC846BW  [SOT323]
U53  NPN  BC846BW  [SOT323]
U54  NPN  BC846BW  [SOT323]
U56  NPN  BC846BW  [SOT323]
U57  NPN  BC846BW  [SOT323]
U59  NPN  BC846BW  [SOT323]

### Nets
ESTOP: R104.P$2 R105.P$2 U56.2(E(1)) ; also sheet 1
GND: J9.1 J10.1 J11.1 J13.1 J14.1 J15.1 J16.1 J17.1 J18.1 J19.1 J20.1 J21.1 J22.1 J23.1 J24.1 J26.1 J27.1 J28.1 J30.1 J31.1 J33.1 J35.1 LED3.2(C) LED4.2(C) LED5.2(C) LED7.2(C) LED8.2(C) LED9.2(C) LED11.2(C) LED12.2(C) LED14.2(C) LED16.2(C) R63.P$1 R69.P$1 R72.P$1 R78.P$1 R81.P$1 R84.P$1 R90.P$1 R93.P$1 R99.P$1 R105.P$1 U9.2(E(1)) U10.2(E(1)) U11.2(E(1)) U12.2(E(1)) U13.2(E(1)) U14.2(E(1)) U15.2(E(1)) U16.2(E(1)) U17.2(E(1)) U18.2(E(1)) U19.2(E(1)) U20.2(E(1)) U21.2(E(1)) U22.2(E(1)) U23.2(E(1)) U24.2(E(1)) U25.2(E(1)) U26.2(E(1)) U27.2(E(1)) U28.2(E(1)) U29.2(E(1)) U30.2(E(1)) U31.2(E(1)) U32.2(E(1)) U33.2(E(1)) U34.2(E(1)) U35.2(E(1)) U36.2(E(1)) U37.2(E(1)) U38.2(E(1)) U39.2(E(1)) U40.2(E(1)) U41.2(E(1)) U43.2(E(1)) U45.2(E(1)) U46.2(E(1)) U47.2(E(1)) U53.2(E(1)) U57.2(E(1)) U59.2(E(1)) ; also sheet 1,2,3,5
LS_01: R62.P$2 R63.P$2 U7.2(E(1)) ; also sheet 1
LS_02: R71.P$2 R72.P$2 U42.2(E(1)) ; also sheet 1
LS_03: R77.P$2 R78.P$2 U44.2(E(1)) ; also sheet 1
LS_04: R83.P$2 R84.P$2 U49.2(E(1)) ; also sheet 1
LS_05: R89.P$2 R90.P$2 U51.2(E(1)) ; also sheet 1
LS_06: R68.P$2 R69.P$2 U8.2(E(1)) ; also sheet 1
LS_07: R80.P$2 R81.P$2 U48.2(E(1)) ; also sheet 1
LS_08: R92.P$2 R93.P$2 U52.2(E(1)) ; also sheet 1
LS_09: R98.P$2 R99.P$2 U54.2(E(1)) ; also sheet 1
LS_RET: J9.2 J11.2 J23.2 J26.2 J27.2 J28.2 J30.2 J31.2 J33.2 J35.2 R61.P$1 R67.P$1 R70.P$1 R76.P$1 R79.P$1 R82.P$1 R88.P$1 R91.P$1 R97.P$1 R103.P$1
M1_DIR: R29.P$1 ; also sheet 1
M1_ENABLE: R30.P$1 ; also sheet 1
M1_STEP: R28.P$1 ; also sheet 1
M2_DIR: R32.P$1 ; also sheet 1
M2_ENABLE: R33.P$1 ; also sheet 1
M2_STEP: R31.P$1 ; also sheet 1
M3_DIR: R35.P$1 ; also sheet 1
M3_ENABLE: R36.P$1 ; also sheet 1
M3_STEP: R34.P$1 ; also sheet 1
M4_DIR: R38.P$1 ; also sheet 1
M4_ENABLE: R39.P$1 ; also sheet 1
M4_STEP: R37.P$1 ; also sheet 1
M5_DIR: R41.P$1 ; also sheet 1
M5_ENABLE: R42.P$1 ; also sheet 1
M5_STEP: R40.P$1 ; also sheet 1
M6_DIR: R47.P$1 ; also sheet 1
M6_ENABLE: R48.P$1 ; also sheet 1
M6_STEP: R46.P$1 ; also sheet 1
M7_DIR: R53.P$1 ; also sheet 1
M7_ENABLE: R54.P$1 ; also sheet 1
M7_STEP: R52.P$1 ; also sheet 1
M8_DIR: R59.P$1 ; also sheet 1
M8_ENABLE: R60.P$1 ; also sheet 1
M8_STEP: R58.P$1 ; also sheet 1
M9_DIR: R44.P$1 ; also sheet 1
M9_ENABLE: R45.P$1 ; also sheet 1
M9_STEP: R43.P$1 ; also sheet 1
M10_DIR: R56.P$1 ; also sheet 1
M10_ENABLE: R57.P$1 ; also sheet 1
M10_STEP: R55.P$1 ; also sheet 1
M11_DIR: R65.P$1 ; also sheet 1
M11_ENABLE: R66.P$1 ; also sheet 1
M11_STEP: R64.P$1 ; also sheet 1
M12_DIR: R50.P$1 ; also sheet 1
M12_ENABLE: R51.P$1 ; also sheet 1
M12_STEP: R49.P$1 ; also sheet 1
MO_DIR: J10.3 J13.3 J14.3 J15.3 J16.3 J17.3 J18.3 J19.3 J20.3 J21.3 J22.3 J24.3 U10.3(C(3)) U13.3(C(3)) U16.3(C(3)) U19.3(C(3)) U22.3(C(3)) U25.3(C(3)) U28.3(C(3)) U31.3(C(3)) U34.3(C(3)) U37.3(C(3)) U40.3(C(3)) U46.3(C(3))
MO_ENABLE: J10.2 J13.2 J14.2 J15.2 J16.2 J17.2 J18.2 J19.2 J20.2 J21.2 J22.2 J24.2 U11.3(C(3)) U14.3(C(3)) U17.3(C(3)) U20.3(C(3)) U23.3(C(3)) U26.3(C(3)) U29.3(C(3)) U32.3(C(3)) U35.3(C(3)) U38.3(C(3)) U41.3(C(3)) U47.3(C(3))
MO_STEP: J10.4 J13.4 J14.4 J15.4 J16.4 J17.4 J18.4 J19.4 J20.4 J21.4 J22.4 J24.4 U9.3(C(3)) U12.3(C(3)) U15.3(C(3)) U18.3(C(3)) U21.3(C(3)) U24.3(C(3)) U27.3(C(3)) U30.3(C(3)) U33.3(C(3)) U36.3(C(3)) U39.3(C(3)) U45.3(C(3))
N$11: R61.P$2 U7.1(B(2))
N$12: R29.P$2 U10.1(B(2))
N$13: R30.P$2 U11.1(B(2))
N$14: R28.P$2 U9.1(B(2))
N$15: R32.P$2 U13.1(B(2))
N$16: R33.P$2 U14.1(B(2))
N$17: R31.P$2 U12.1(B(2))
N$18: R35.P$2 U16.1(B(2))
N$19: R36.P$2 U17.1(B(2))
N$20: R34.P$2 U15.1(B(2))
N$21: R38.P$2 U19.1(B(2))
N$22: R39.P$2 U20.1(B(2))
N$23: R37.P$2 U18.1(B(2))
N$24: R41.P$2 U22.1(B(2))
N$25: R42.P$2 U23.1(B(2))
N$26: R40.P$2 U21.1(B(2))
N$27: R44.P$2 U25.1(B(2))
N$28: R45.P$2 U26.1(B(2))
N$29: R43.P$2 U24.1(B(2))
N$30: R47.P$2 U28.1(B(2))
N$31: R48.P$2 U29.1(B(2))
N$32: R46.P$2 U27.1(B(2))
N$33: R50.P$2 U31.1(B(2))
N$34: R51.P$2 U32.1(B(2))
N$35: R49.P$2 U30.1(B(2))
N$36: R53.P$2 U34.1(B(2))
N$37: R54.P$2 U35.1(B(2))
N$38: R52.P$2 U33.1(B(2))
N$39: R56.P$2 U37.1(B(2))
N$40: R57.P$2 U38.1(B(2))
N$41: R55.P$2 U36.1(B(2))
N$42: R59.P$2 U40.1(B(2))
N$43: R60.P$2 U41.1(B(2))
N$44: R58.P$2 U39.1(B(2))
N$45: LED3.1(A) R62.P$1
N$46: R67.P$2 U8.1(B(2))
N$47: LED4.1(A) R68.P$1
N$48: R65.P$2 U46.1(B(2))
N$49: R66.P$2 U47.1(B(2))
N$50: R64.P$2 U45.1(B(2))
N$51: R70.P$2 U42.1(B(2))
N$52: LED5.1(A) R71.P$1
N$54: R27.P$2 U43.1(B(2))
N$55: R76.P$2 U44.1(B(2))
N$56: LED7.1(A) R77.P$1
N$57: R79.P$2 U48.1(B(2))
N$58: LED8.1(A) R80.P$1
N$59: R82.P$2 U49.1(B(2))
N$60: LED9.1(A) R83.P$1
N$61: J25.2 LED6.2(C) U43.3(C(3))
N$62: LED6.1(A) R73.P$1
N$63: R88.P$2 U51.1(B(2))
N$64: LED11.1(A) R89.P$1
N$65: R91.P$2 U52.1(B(2))
N$66: LED12.1(A) R92.P$1
N$69: R97.P$2 U54.1(B(2))
N$70: LED14.1(A) R98.P$1
N$72: R85.P$2 U53.1(B(2))
N$73: R103.P$2 U56.1(B(2))
N$74: LED16.1(A) R104.P$1
N$75: J32.2 LED13.2(C) U53.3(C(3))
N$76: LED13.1(A) R86.P$1
N$80: R95.P$2 U57.1(B(2))
N$81: J36.2 LED17.2(C) U57.3(C(3))
N$82: LED17.1(A) R96.P$1
N$86: R102.P$2 U59.1(B(2))
N$87: J38.2 LED19.2(C) U59.3(C(3))
N$88: LED19.1(A) R106.P$1
P0_00: J4.P$2 ; also sheet 1
P0_01: J4.P$1 ; also sheet 1
P0_02: J5.1 ; also sheet 1
P0_03: J5.3 ; also sheet 1
P0_04: J5.5 ; also sheet 1
P0_05: J5.7 ; also sheet 1
P0_06: J5.9 ; also sheet 1
P0_07: J5.10 ; also sheet 1
P0_08: J5.8 ; also sheet 1
P0_09: J5.6 ; also sheet 1
P0_14: J5.4 ; also sheet 1
P0_15: J5.2 ; also sheet 1
P2_01: J4.P$9 ; also sheet 1
P3_10: J12.1 ; also sheet 1
P3_11: J12.2 ; also sheet 1
P3_12: J12.3 ; also sheet 1
P3_15: J12.10 ; also sheet 1
P4_00: J4.P$7 ; also sheet 1
P4_01: J4.P$8 ; also sheet 1
P4_08: J4.P$20 ; also sheet 1
P4_09: J4.P$19 ; also sheet 1
P4_10: J4.P$18 ; also sheet 1
P4_11: J4.P$17 ; also sheet 1
P4_12: J4.P$16 ; also sheet 1
P4_13: J4.P$15 ; also sheet 1
P4_14: J4.P$14 ; also sheet 1
P4_15: J4.P$13 ; also sheet 1
P5_11: J4.P$6 ; also sheet 1
P5_12: J4.P$5 ; also sheet 1
P5_13: J4.P$4 ; also sheet 1
P7_06: J4.P$10 ; also sheet 1
P7_07: J4.P$11 ; also sheet 1
P8_05: J4.P$3 ; also sheet 1
P9_00: J12.9 ; also sheet 1
P9_01: J12.8 ; also sheet 1
P9_05: J12.4 ; also sheet 1
P9_06: J12.5 ; also sheet 1
P9_07: J12.6 ; also sheet 1
P9_08: J12.7 ; also sheet 1
PB_00: J4.P$12 ; also sheet 1
RELAY_01: R102.P$1 ; also sheet 1
RELAY_02: R95.P$1 ; also sheet 1
RELAY_03: R85.P$1 ; also sheet 1
RELAY_04: R27.P$1 ; also sheet 1
VDD: U7.3(C(3)) U8.3(C(3)) U42.3(C(3)) U44.3(C(3)) U48.3(C(3)) U49.3(C(3)) U51.3(C(3)) U52.3(C(3)) U54.3(C(3)) U56.3(C(3)) ; also sheet 1,2,3,5
VDD5: J25.1 J32.1 J36.1 J38.1 R73.P$2 R86.P$2 R96.P$2 R106.P$2 ; also sheet 2,5

## Sheet 5 of 5: Power Input
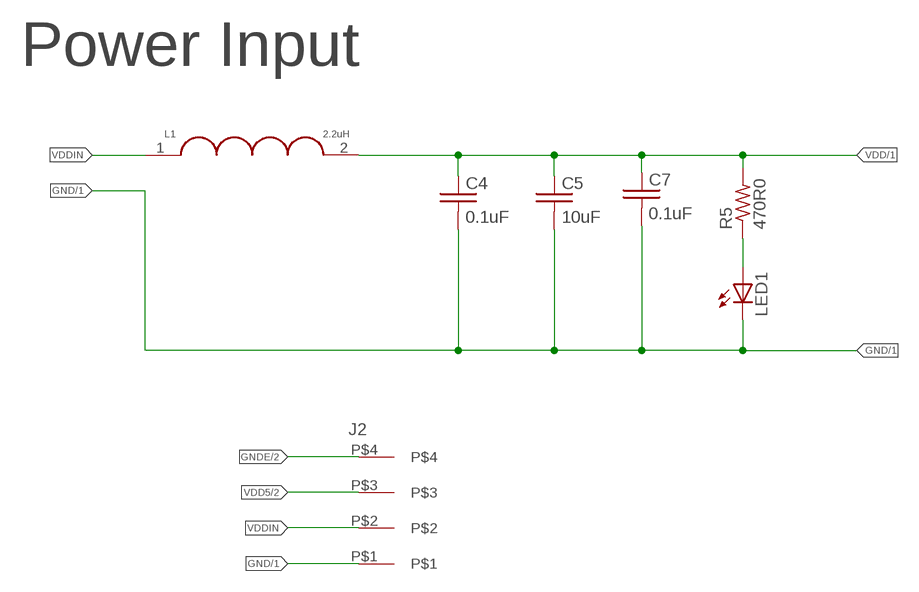
[diagram p6: schematic, sheet 5]

### Parts
C4  0.1uF  C_0402_0.1UF  [0402]
C5  10uF  C_0402_10UF  [0402]
C7  0.1uF  C_0402_0.1UF  [0402]
J2  4-pos  3.81MM_1_X_4_RT_ANGLE_PLUG_HEADER  [1X4_3.81MM_PITCH]
L1  2.2uH  INDUCTOR_1008_2.2_MH_1.3A  [1008]
LED1  Green  LED_0805_GREEN  [0805]
R5  470R0  R_0402_470R0  [0402]

### Nets
GND: C4.P$2 C5.P$2 C7.P$2 J2.P$1 LED1.2(C) ; also sheet 1,2,3,4
GNDE: J2.P$4 ; also sheet 2,3
N$3: LED1.1(A) R5.P$1
VDD: C4.P$1 C5.P$1 C7.P$1 L1.2 R5.P$2 ; also sheet 1,2,3,4
VDD5: J2.P$3 ; also sheet 2,4
VDDIN: J2.P$2 L1.1

### Notes on the sheet
- Power Input

## Library data of the parts
AFID1-AFID6 = 3D_MIG_Controller:FIDUCIAL_1MM: For use by pick and place machines to calibrate the vision/machine, 1mm By microbuilder.eu
C1 = 3D_MIG_Controller:TLJT107M010R0900; COPYRIGHT: Copyright (C) 2023 Ultra Librarian. All rights reserved.; DIGIKEY_PART_NUMBER_1: 478-9011-1-ND; DIGIKEY_PART_NUMBER_2: 478-9011-2-ND; DIGIKEY_PART_NUMBER_3: 478-9011-6-ND; MANUFACTURER_PART_NUMBER: TLJT107M010R0900; MFR_NAME: Diodes Inc
C4 C7 C19 C20 C22 C24-C27 C29 C30 C33-C36 C38-C40 C42 C43 = 3D_MIG_Controller:C_0402_0.1UF; PARTNO: CL05F104ZO5NNNC
C5 C16 C23 = 3D_MIG_Controller:C_0402_10UF; PARTNO: CL05A106MP8NUB8
C13-C15 C44 C46-C48 C51 U$4 = 3D_MIG_Controller:C_0402
C17 C18 = 3D_MIG_Controller:C_0402_18PF; PARTNO: UMK105CG180JV-F
C21 C28 C41 = 3D_MIG_Controller:C_0402_1UF; PARTNO: CL05A105KO5NNNC
C32 C37 = 3D_MIG_Controller:C_0402_12PF; PARTNO: CL05C120JB5NNNC
C45 C50 = 3D_MIG_Controller:C_0603
C49 R25-R27 R61 R67 R70 R74-R76 R79 R82 R85 R87 R88 R91 R94 R95 R97 R100-R103 R107-R109 = 3D_MIG_Controller:R_0402
FB2/2 = 3D_MIG_Controller:FB_0805_120_OHM
J1 = 3D_MIG_Controller:SD_CARD_1140084168: Conn; IC Socket; Micro SD; Right Angle; PCB Mount; MicroSD Ser.:: 10 _8 + 2_ Position Card Connector Secure Digital - microSD™ Surface Mount, Right Angle Gold; MF: Amphenol ICC; PARTNO: 114-00841-68; VID: Digikey; VP: 114-00841-68-1-ND; VURL: https://www.digikey.ae/product-detail/en/amphenol-icc-commercial-products/114-00841-68/114-00841-68-1-ND/2187101?utm_source=snapeda&utm_medium=aggregator&utm_campaign=symbol
J2 = 3D_MIG_Controller:3.81MM_1_X_4_RT_ANGLE_PLUG_HEADER: 4 Position Terminal Block Header, Male Pins, Shrouded (4 Side) 0.150" (3.81mm) 90°, Right Angle - Through Hole; PARTNO: 691322310004
J3 J5 J12 = 3D_MIG_Controller:CONN_05X2_RA: Connector Header Through Hole, Right Angle 10 position 0.100" (2.54mm); PARTNO: PH2RA-10-UA
J4 = 3D_MIG_Controller:2_X_10_HEADER_GENERIC: CONN HEADER R/A 20POS 2.54MM, Straight, Right Angle; PARTNO: 67996-420HLF
J6 = 3D_MIG_Controller:USB_A: USB-A Connector Male and female variants, as well as PTH and SMT variants SparkFun Products: SparkFun XBee Explorer Dongle <https://www.sparkfun.com/products/11697> PTH Male SparkFun MicroView-USB Programmer <https://www.sparkfun.com/products/12924> SMT Male SparkFun USB Type A Female Breakout <https://www.sparkfun.com/products/12700> SMT Female; NOZZLE: CN400; PARTNO: 87583-3010RPALF
J7 = 3D_MIG_Controller:USB_MICRO-B; PARTNO: 10118192-0002LF
J9 J11 J23 J25-J28 J30-J33 J35 J36 J38 = 3D_MIG_Controller:CONN_530470210_PICOBLADE_X_2; COPYRIGHT: Copyright (C) 2022 Ultra Librarian. All rights reserved.; MANUFACTURER_PART_NUMBER: 530470210; MFR_NAME: Molex Connector Corporation
J10 J13-J22 J24 = 3D_MIG_Controller:CONN_530470410_PICOBLADE_X_4; COPYRIGHT: Copyright (C) 2022 Ultra Librarian. All rights reserved.; MANUFACTURER_PART_NUMBER: 530470410; MFR_NAME: Molex Connector Corporation
L1 = 3D_MIG_Controller:INDUCTOR_1008_2.2_MH_1.3A; PARTNO: LQM2HPN2R2MG0L
LED1 LED3-LED9 LED11-LED14 LED16 LED17 LED19 = 3D_MIG_Controller:LED_0805_GREEN: Green 570nm LED Indication - Discrete 2.2V 0805 (2012 Metric); PARTNO: LG R971-KN-1
R5 R62 R68 R71 R73 R77 R80 R83 R86 R89 R92 R96 R98 R104 R106 = 3D_MIG_Controller:R_0402_470R0; PARTNO: RMCF0402JT470R
R13 R19 R20 R23 R24 R63 R69 R72 R78 R81 R84 R90 R93 R99 R105 = 3D_MIG_Controller:R_0402_10K0; PARTNO: RMCF0402JT10K0
R14 R15 = 3D_MIG_Controller:R_0402_1K0; PARTNO: CRG0402J1K0
R16 = 3D_MIG_Controller:R_0402_15K0; PARTNO: RMCF0402JT15K0
R17 R18 = 3D_MIG_Controller:R_0402_27R0; PARTNO: RMCF0402JT27R0
R21 = 3D_MIG_Controller:R_0402_30K0; PARTNO: RC0402JR-0730KL
R22 = 3D_MIG_Controller:R_0402_2K2; PARTNO: RMCF0402JT2K20
R28-R60 R64-R66 = 3D_MIG_Controller:R_0402_33R0; PARTNO: RMCF0402JT33R0
U2 = 3D_MIG_Controller:AP2151DWG-7: Power Switch/Driver 1:1 P-Channel 500mA SOT-25; PARTNO: AP2151WG-7
U3 = 3D_MIG_Controller:RENESAS_S7G2_X_176; PARTNO: R7FS7G27H3A01CFC#AA0
U4 U5 = 3D_MIG_Controller:TPD2E2U06DRLR: TVS DIODE 5.5V 12.4V SOT5; PARTNO: TPD2E2U06DRLR
U6 = 3D_MIG_Controller:KSZ8081RNACA; MANUFACTURER_PART_NUMBER: KSZ8081RNACA; VENDOR: Micrel
U7-U49 U51-U54 U56 U57 U59 = 3D_MIG_Controller:BC846BW: Bipolar (BJT) Transistor NPN 100MHz Surface Mount SOT-323; PARTNO: BC846BW_NPN
U$2 = 3D_MIG_Controller:RJ45_WITH_ELEC
U$3 = 3D_MIG_Controller:XTAL_25_MHZ
X2 = 3D_MIG_Controller:XTAL_24_MHZ; PARTNO: FA-238 24.0000MB-C3
X3 = 3D_MIG_Controller:XTAL_32.768KHZ; PARTNO: ABS07-32.768KHZ-T